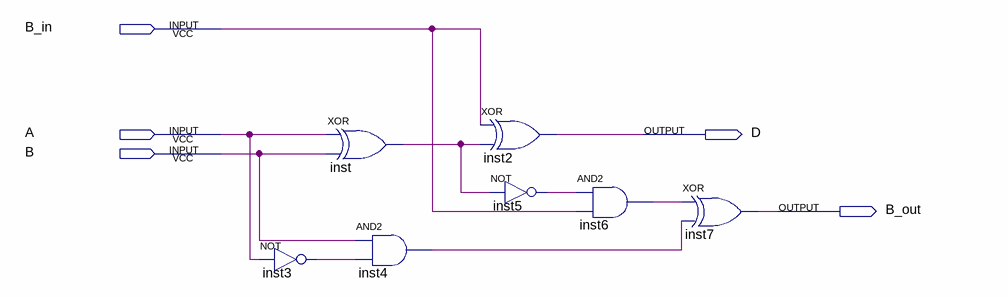
[diagram p0: schematic sheet]
// Quartus schematic FullSubtractor2bit.bdf as structural Verilog: 7 symbols, 5 pins
module FullSubtractor2bit (
  input  B_in,
  input  A,
  input  B,
  output D,
  output B_out
);

  wire inst3_out, inst4_out, inst5_out, inst6_out, inst_out;

  not inst3 (inst3_out, A);
  xor inst (inst_out, A, B);
  and inst4 (inst4_out, B, inst3_out);
  xor inst2 (D, B_in, inst_out);
  not inst5 (inst5_out, inst_out);
  and inst6 (inst6_out, inst5_out, B_in);
  xor inst7 (B_out, inst6_out, inst4_out);
endmodule
